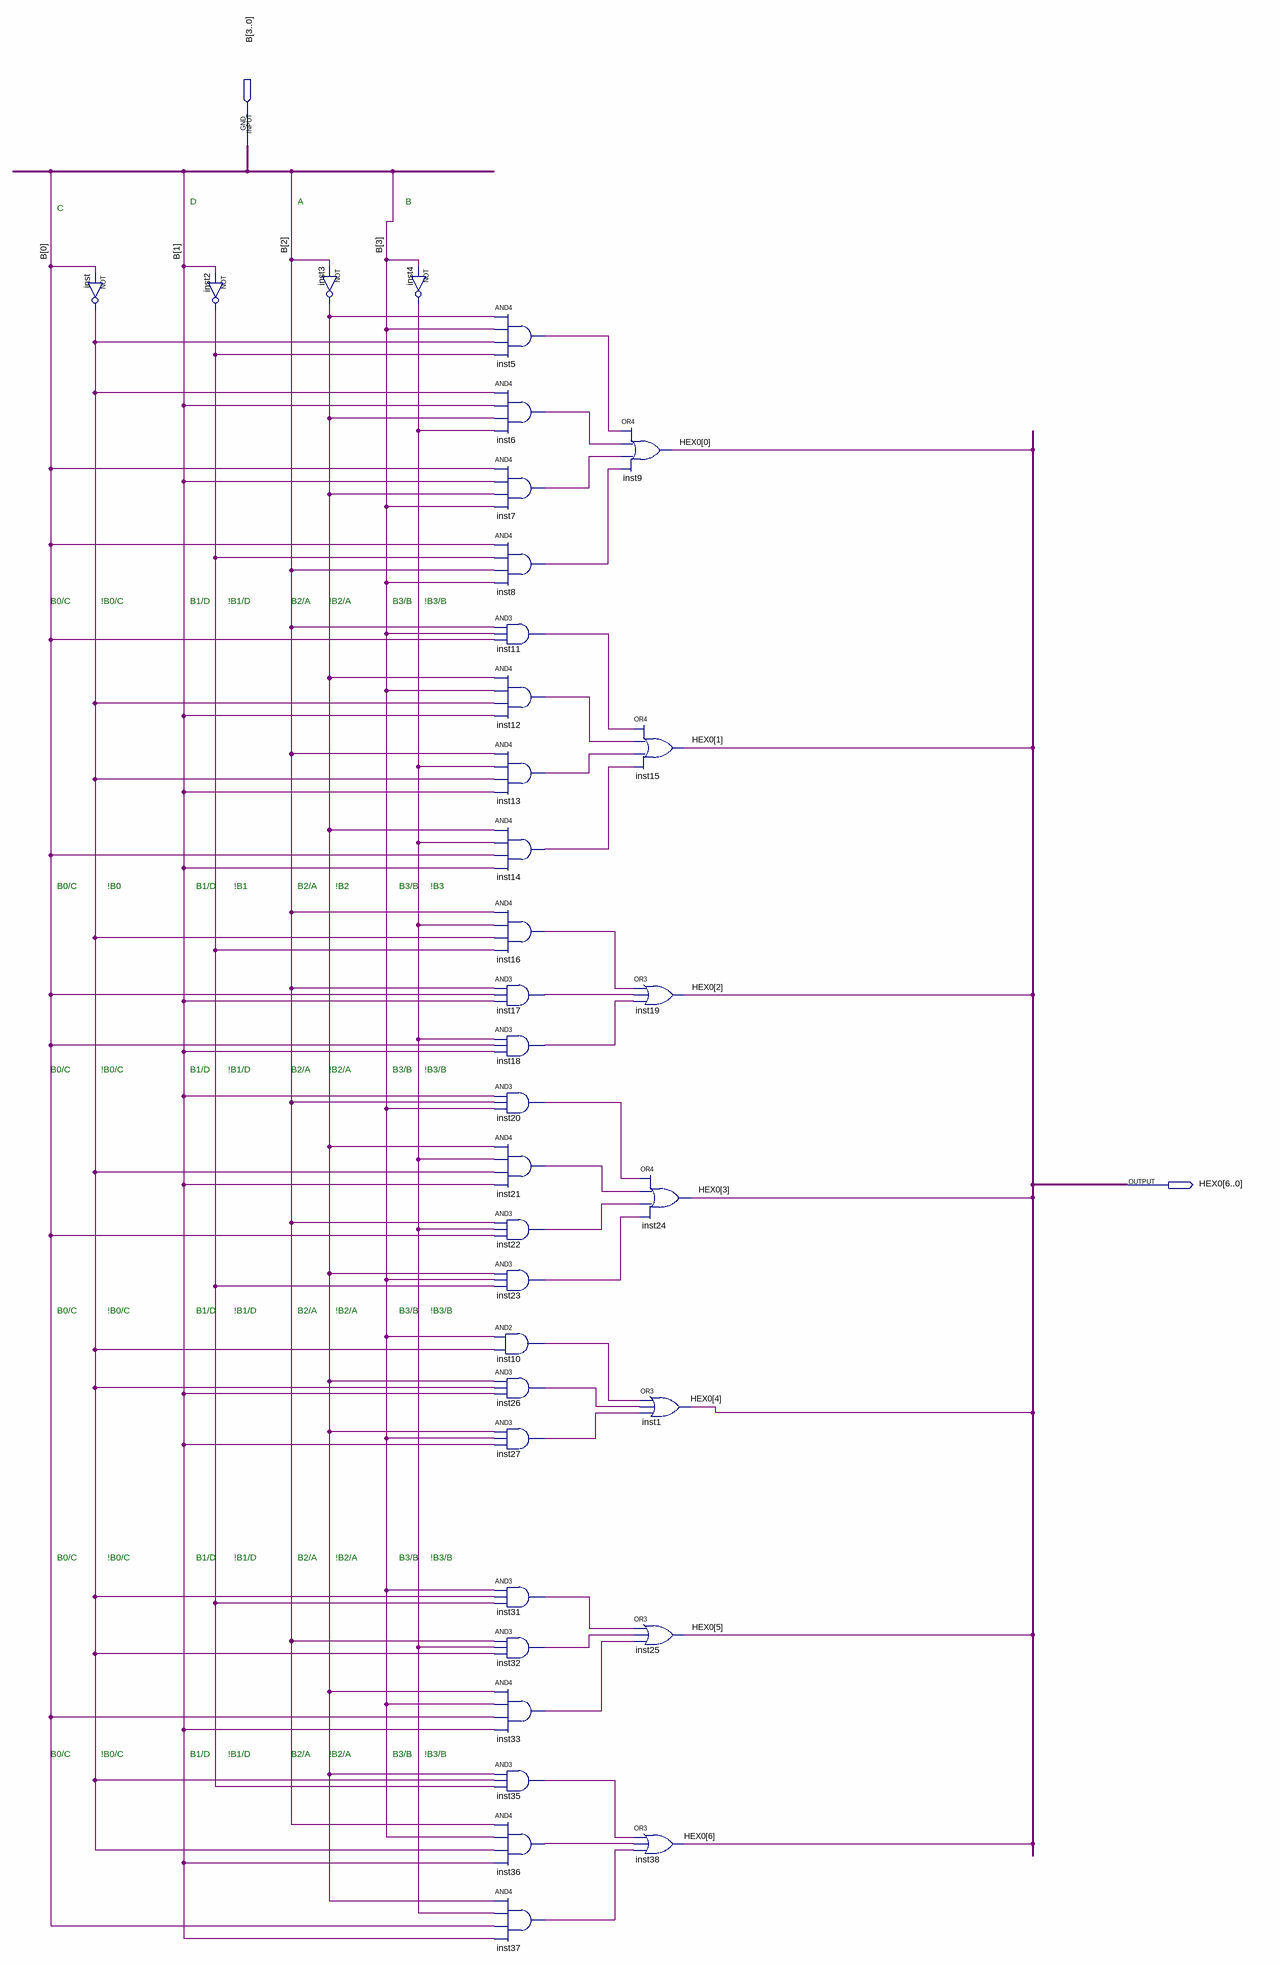
[diagram p0: schematic sheet]
// Quartus schematic DispDriver.bdf as structural Verilog: 35 symbols, 2 pins
module DispDriver (
  input  [3:0] B,
  output [6:0] HEX0
);

  wire inst2_out, inst3_out, inst4_out, inst5_out, inst6_out, inst7_out, inst8_out, inst10_out, inst11_out,
       inst12_out, inst13_out, inst14_out, inst16_out, inst17_out, inst18_out, inst20_out, inst21_out,
       inst22_out, inst23_out, inst26_out, inst27_out, inst31_out, inst32_out, inst33_out, inst35_out,
       inst36_out, inst37_out, inst_out;

  not inst (inst_out, B[0]);
  not inst2 (inst2_out, B[1]);
  not inst3 (inst3_out, B[2]);
  not inst4 (inst4_out, B[3]);
  and inst5 (inst5_out, inst3_out, B[3], inst_out, inst2_out);
  and inst6 (inst6_out, inst_out, B[1], inst3_out, inst4_out);
  and inst7 (inst7_out, B[0], B[1], inst3_out, B[3]);
  and inst8 (inst8_out, B[0], inst2_out, B[2], B[3]);
  and inst11 (inst11_out, B[2], B[3], B[0]);
  and inst12 (inst12_out, inst3_out, B[3], inst_out, B[1]);
  and inst13 (inst13_out, B[2], inst4_out, inst_out, B[1]);
  and inst14 (inst14_out, inst3_out, inst4_out, B[0], B[1]);
  and inst16 (inst16_out, B[2], inst4_out, inst_out, inst2_out);
  and inst17 (inst17_out, B[2], B[0], B[1]);
  and inst18 (inst18_out, inst4_out, B[0], B[1]);
  and inst20 (inst20_out, B[1], B[2], B[3]);
  and inst21 (inst21_out, inst3_out, inst4_out, inst_out, B[1]);
  and inst22 (inst22_out, B[2], inst4_out, B[0]);
  and inst23 (inst23_out, inst3_out, B[3], inst2_out);
  and inst10 (inst10_out, B[3], inst_out);
  and inst26 (inst26_out, inst3_out, inst_out, B[1]);
  and inst27 (inst27_out, inst3_out, B[3], B[1]);
  and inst31 (inst31_out, B[3], inst_out, inst2_out);
  and inst32 (inst32_out, B[2], inst4_out, inst_out);
  and inst33 (inst33_out, inst3_out, B[3], B[0], B[1]);
  and inst35 (inst35_out, inst3_out, inst_out, inst2_out);
  and inst36 (inst36_out, B[2], B[3], inst_out, B[1]);
  and inst37 (inst37_out, inst3_out, inst4_out, B[0], B[1]);
  or inst9 (HEX0[0], inst5_out, inst6_out, inst7_out, inst8_out);
  or inst15 (HEX0[1], inst11_out, inst12_out, inst13_out, inst14_out);
  or inst19 (HEX0[2], inst16_out, inst17_out, inst18_out);
  or inst24 (HEX0[3], inst20_out, inst21_out, inst22_out, inst23_out);
  or inst1 (HEX0[4], inst10_out, inst26_out, inst27_out);
  or inst25 (HEX0[5], inst31_out, inst32_out, inst33_out);
  or inst38 (HEX0[6], inst35_out, inst36_out, inst37_out);

  // Notes on the sheet:
  //   D
  //   A
  //   B
  //   C
  //   B0/C
  //   !B0/C
  //   B1/D
  //   !B1/D
  //   B2/A
  //   !B2/A
  //   B3/B
  //   !B3/B
  //   B0/C
  //   !B0
  //   B1/D
  //   !B1
  //   B2/A
  //   !B2
  //   B3/B
  //   !B3
  //   B0/C
  //   !B0/C
  //   B1/D
  //   !B1/D
  //   B2/A
  //   !B2/A
  //   B3/B
  //   !B3/B
  //   B0/C
  //   !B0/C
  //   B1/D
  //   !B1/D
  //   B2/A
  //   !B2/A
  //   B3/B
  //   !B3/B
  //   B0/C
  //   !B0/C
  //   B1/D
  //   !B1/D
  //   B2/A
  //   !B2/A
  //   B3/B
  //   !B3/B
  //   B0/C
  //   !B0/C
  //   B1/D
  //   !B1/D
  //   B2/A
  //   !B2/A
  //   B3/B
  //   !B3/B
endmodule
